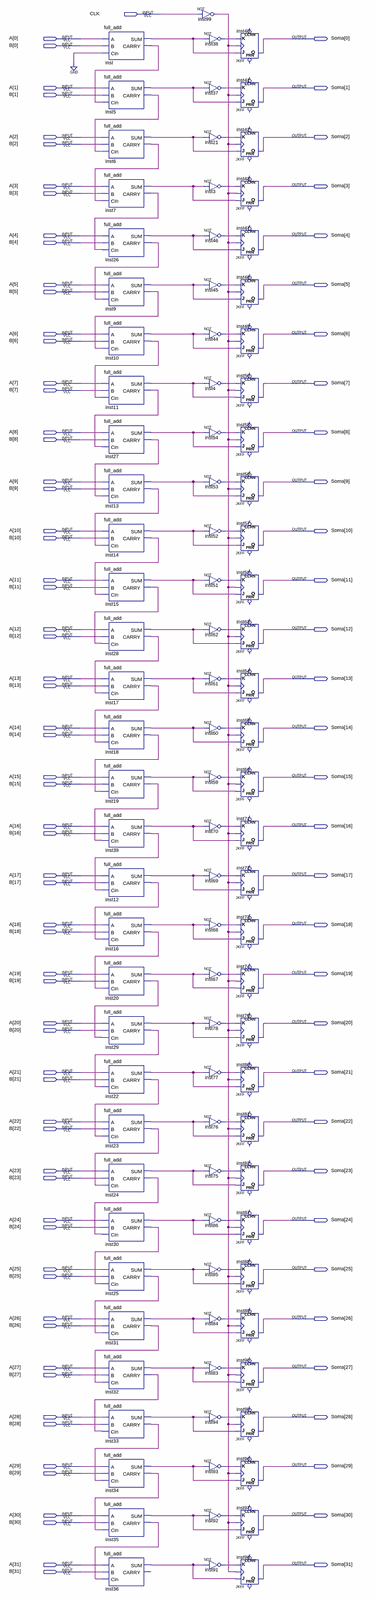
[diagram p0: schematic sheet, whole]
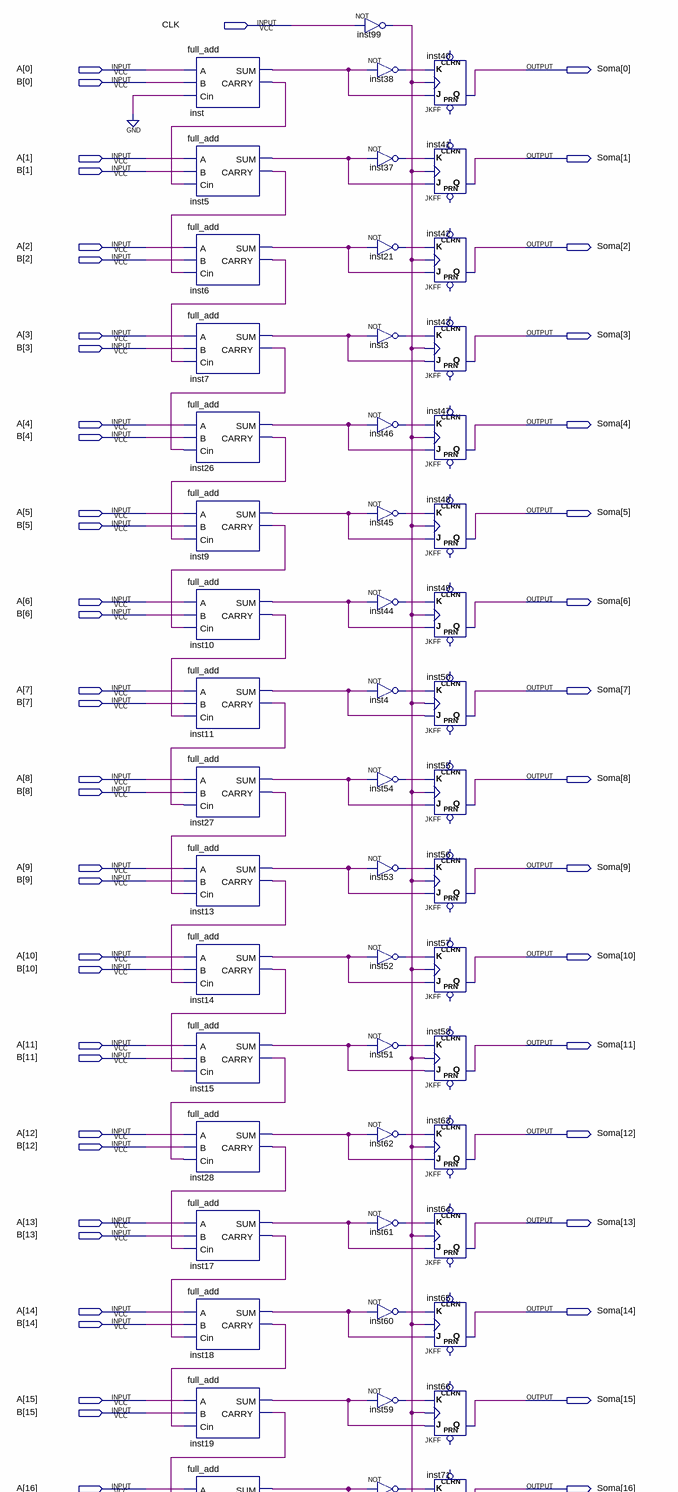
[diagram p1: schematic sheet, upper part]
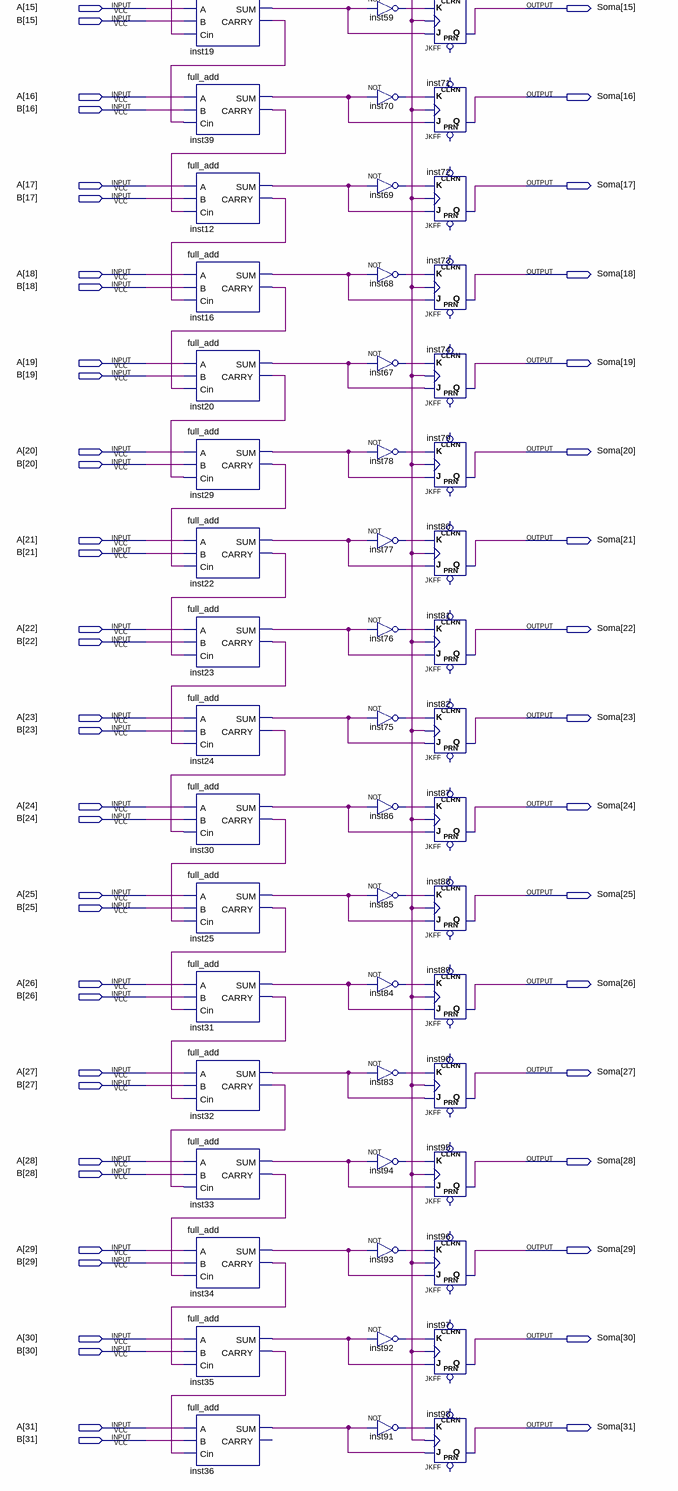
[diagram p2: schematic sheet, lower part]
// Quartus schematic add32-sincrono.bdf as structural Verilog: 97 symbols, 97 pins
module \add32-sincrono  (
  input  CLK,
  input  [31:0] A,
  input  [31:0] B,
  output [31:0] Soma
);

  wire inst3_out, inst4_out, inst5_carry, inst5_sum, inst6_carry, inst6_sum, inst7_carry, inst7_sum,
       inst9_carry, inst9_sum, inst10_carry, inst10_sum, inst11_carry, inst11_sum, inst12_carry, inst12_sum,
       inst13_carry, inst13_sum, inst14_carry, inst14_sum, inst15_carry, inst15_sum, inst16_carry,
       inst16_sum, inst17_carry, inst17_sum, inst18_carry, inst18_sum, inst19_carry, inst19_sum,
       inst20_carry, inst20_sum, inst21_out, inst22_carry, inst22_sum, inst23_carry, inst23_sum,
       inst24_carry, inst24_sum, inst25_carry, inst25_sum, inst26_carry, inst26_sum, inst27_carry,
       inst27_sum, inst28_carry, inst28_sum, inst29_carry, inst29_sum, inst30_carry, inst30_sum,
       inst31_carry, inst31_sum, inst32_carry, inst32_sum, inst33_carry, inst33_sum, inst34_carry,
       inst34_sum, inst35_carry, inst35_sum, inst36_sum, inst37_out, inst38_out, inst39_carry, inst39_sum,
       inst44_out, inst45_out, inst46_out, inst51_out, inst52_out, inst53_out, inst54_out, inst59_out,
       inst60_out, inst61_out, inst62_out, inst67_out, inst68_out, inst69_out, inst70_out, inst75_out,
       inst76_out, inst77_out, inst78_out, inst83_out, inst84_out, inst85_out, inst86_out, inst91_out,
       inst92_out, inst93_out, inst94_out, inst99_out, inst_carry, inst_sum;

  full_add inst (.A(A[0]), .B(B[0]), .Cin(1'b0), .SUM(inst_sum), .CARRY(inst_carry));
  full_add inst5 (.A(A[1]), .B(B[1]), .Cin(inst_carry), .SUM(inst5_sum), .CARRY(inst5_carry));
  full_add inst6 (.A(A[2]), .B(B[2]), .Cin(inst5_carry), .SUM(inst6_sum), .CARRY(inst6_carry));
  full_add inst7 (.A(A[3]), .B(B[3]), .Cin(inst6_carry), .SUM(inst7_sum), .CARRY(inst7_carry));
  full_add inst26 (.A(A[4]), .B(B[4]), .Cin(inst7_carry), .SUM(inst26_sum), .CARRY(inst26_carry));
  full_add inst9 (.A(A[5]), .B(B[5]), .Cin(inst26_carry), .SUM(inst9_sum), .CARRY(inst9_carry));
  full_add inst10 (.A(A[6]), .B(B[6]), .Cin(inst9_carry), .SUM(inst10_sum), .CARRY(inst10_carry));
  full_add inst11 (.A(A[7]), .B(B[7]), .Cin(inst10_carry), .SUM(inst11_sum), .CARRY(inst11_carry));
  full_add inst27 (.A(A[8]), .B(B[8]), .Cin(inst11_carry), .SUM(inst27_sum), .CARRY(inst27_carry));
  full_add inst13 (.A(A[9]), .B(B[9]), .Cin(inst27_carry), .SUM(inst13_sum), .CARRY(inst13_carry));
  full_add inst14 (.A(A[10]), .B(B[10]), .Cin(inst13_carry), .SUM(inst14_sum), .CARRY(inst14_carry));
  full_add inst15 (.A(A[11]), .B(B[11]), .Cin(inst14_carry), .SUM(inst15_sum), .CARRY(inst15_carry));
  full_add inst28 (.A(A[12]), .B(B[12]), .Cin(inst15_carry), .SUM(inst28_sum), .CARRY(inst28_carry));
  full_add inst17 (.A(A[13]), .B(B[13]), .Cin(inst28_carry), .SUM(inst17_sum), .CARRY(inst17_carry));
  full_add inst18 (.A(A[14]), .B(B[14]), .Cin(inst17_carry), .SUM(inst18_sum), .CARRY(inst18_carry));
  full_add inst19 (.A(A[15]), .B(B[15]), .Cin(inst18_carry), .SUM(inst19_sum), .CARRY(inst19_carry));
  full_add inst39 (.A(A[16]), .B(B[16]), .Cin(inst19_carry), .SUM(inst39_sum), .CARRY(inst39_carry));
  full_add inst12 (.A(A[17]), .B(B[17]), .Cin(inst39_carry), .SUM(inst12_sum), .CARRY(inst12_carry));
  full_add inst16 (.A(A[18]), .B(B[18]), .Cin(inst12_carry), .SUM(inst16_sum), .CARRY(inst16_carry));
  full_add inst20 (.A(A[19]), .B(B[19]), .Cin(inst16_carry), .SUM(inst20_sum), .CARRY(inst20_carry));
  full_add inst29 (.A(A[20]), .B(B[20]), .Cin(inst20_carry), .SUM(inst29_sum), .CARRY(inst29_carry));
  full_add inst22 (.A(A[21]), .B(B[21]), .Cin(inst29_carry), .SUM(inst22_sum), .CARRY(inst22_carry));
  full_add inst23 (.A(A[22]), .B(B[22]), .Cin(inst22_carry), .SUM(inst23_sum), .CARRY(inst23_carry));
  full_add inst24 (.A(A[23]), .B(B[23]), .Cin(inst23_carry), .SUM(inst24_sum), .CARRY(inst24_carry));
  full_add inst30 (.A(A[24]), .B(B[24]), .Cin(inst24_carry), .SUM(inst30_sum), .CARRY(inst30_carry));
  full_add inst25 (.A(A[25]), .B(B[25]), .Cin(inst30_carry), .SUM(inst25_sum), .CARRY(inst25_carry));
  full_add inst31 (.A(A[26]), .B(B[26]), .Cin(inst25_carry), .SUM(inst31_sum), .CARRY(inst31_carry));
  full_add inst32 (.A(A[27]), .B(B[27]), .Cin(inst31_carry), .SUM(inst32_sum), .CARRY(inst32_carry));
  full_add inst33 (.A(A[28]), .B(B[28]), .Cin(inst32_carry), .SUM(inst33_sum), .CARRY(inst33_carry));
  full_add inst34 (.A(A[29]), .B(B[29]), .Cin(inst33_carry), .SUM(inst34_sum), .CARRY(inst34_carry));
  full_add inst35 (.A(A[30]), .B(B[30]), .Cin(inst34_carry), .SUM(inst35_sum), .CARRY(inst35_carry));
  full_add inst36 (.A(A[31]), .B(B[31]), .Cin(inst35_carry), .SUM(inst36_sum));  // open: CARRY
  not inst99 (inst99_out, CLK);
  not inst38 (inst38_out, inst_sum);
  not inst37 (inst37_out, inst5_sum);
  not inst21 (inst21_out, inst6_sum);
  not inst3 (inst3_out, inst7_sum);
  not inst46 (inst46_out, inst26_sum);
  not inst45 (inst45_out, inst9_sum);
  not inst44 (inst44_out, inst10_sum);
  not inst4 (inst4_out, inst11_sum);
  not inst54 (inst54_out, inst27_sum);
  not inst53 (inst53_out, inst13_sum);
  not inst52 (inst52_out, inst14_sum);
  not inst51 (inst51_out, inst15_sum);
  not inst62 (inst62_out, inst28_sum);
  not inst61 (inst61_out, inst17_sum);
  not inst60 (inst60_out, inst18_sum);
  not inst59 (inst59_out, inst19_sum);
  not inst70 (inst70_out, inst39_sum);
  not inst69 (inst69_out, inst12_sum);
  not inst68 (inst68_out, inst16_sum);
  not inst67 (inst67_out, inst20_sum);
  not inst78 (inst78_out, inst29_sum);
  not inst77 (inst77_out, inst22_sum);
  not inst76 (inst76_out, inst23_sum);
  not inst75 (inst75_out, inst24_sum);
  not inst86 (inst86_out, inst30_sum);
  not inst85 (inst85_out, inst25_sum);
  not inst84 (inst84_out, inst31_sum);
  not inst83 (inst83_out, inst32_sum);
  not inst94 (inst94_out, inst33_sum);
  not inst93 (inst93_out, inst34_sum);
  not inst92 (inst92_out, inst35_sum);
  not inst91 (inst91_out, inst36_sum);
  JKFF inst40 (.K(inst38_out), .J(inst_sum), .CLK(inst99_out), .Q(Soma[0]));  // open: PRN, CLRN
  JKFF inst41 (.K(inst37_out), .J(inst5_sum), .CLK(inst99_out), .Q(Soma[1]));  // open: PRN, CLRN
  JKFF inst42 (.K(inst21_out), .J(inst6_sum), .CLK(inst99_out), .Q(Soma[2]));  // open: PRN, CLRN
  JKFF inst43 (.K(inst3_out), .J(inst7_sum), .CLK(inst99_out), .Q(Soma[3]));  // open: PRN, CLRN
  JKFF inst47 (.K(inst46_out), .J(inst26_sum), .CLK(inst99_out), .Q(Soma[4]));  // open: PRN, CLRN
  JKFF inst48 (.K(inst45_out), .J(inst9_sum), .CLK(inst99_out), .Q(Soma[5]));  // open: PRN, CLRN
  JKFF inst49 (.K(inst44_out), .J(inst10_sum), .CLK(inst99_out), .Q(Soma[6]));  // open: PRN, CLRN
  JKFF inst50 (.K(inst4_out), .J(inst11_sum), .CLK(inst99_out), .Q(Soma[7]));  // open: PRN, CLRN
  JKFF inst55 (.K(inst54_out), .J(inst27_sum), .CLK(inst99_out), .Q(Soma[8]));  // open: PRN, CLRN
  JKFF inst56 (.K(inst53_out), .J(inst13_sum), .CLK(inst99_out), .Q(Soma[9]));  // open: PRN, CLRN
  JKFF inst57 (.K(inst52_out), .J(inst14_sum), .CLK(inst99_out), .Q(Soma[10]));  // open: PRN, CLRN
  JKFF inst58 (.K(inst51_out), .J(inst15_sum), .CLK(inst99_out), .Q(Soma[11]));  // open: PRN, CLRN
  JKFF inst63 (.K(inst62_out), .J(inst28_sum), .CLK(inst99_out), .Q(Soma[12]));  // open: PRN, CLRN
  JKFF inst64 (.K(inst61_out), .J(inst17_sum), .CLK(inst99_out), .Q(Soma[13]));  // open: PRN, CLRN
  JKFF inst65 (.K(inst60_out), .J(inst18_sum), .CLK(inst99_out), .Q(Soma[14]));  // open: PRN, CLRN
  JKFF inst66 (.K(inst59_out), .J(inst19_sum), .CLK(inst99_out), .Q(Soma[15]));  // open: PRN, CLRN
  JKFF inst71 (.K(inst70_out), .J(inst39_sum), .CLK(inst99_out), .Q(Soma[16]));  // open: PRN, CLRN
  JKFF inst72 (.K(inst69_out), .J(inst12_sum), .CLK(inst99_out), .Q(Soma[17]));  // open: PRN, CLRN
  JKFF inst73 (.K(inst68_out), .J(inst16_sum), .CLK(inst99_out), .Q(Soma[18]));  // open: PRN, CLRN
  JKFF inst74 (.K(inst67_out), .J(inst20_sum), .CLK(inst99_out), .Q(Soma[19]));  // open: PRN, CLRN
  JKFF inst79 (.K(inst78_out), .J(inst29_sum), .CLK(inst99_out), .Q(Soma[20]));  // open: PRN, CLRN
  JKFF inst80 (.K(inst77_out), .J(inst22_sum), .CLK(inst99_out), .Q(Soma[21]));  // open: PRN, CLRN
  JKFF inst81 (.K(inst76_out), .J(inst23_sum), .CLK(inst99_out), .Q(Soma[22]));  // open: PRN, CLRN
  JKFF inst82 (.K(inst75_out), .J(inst24_sum), .CLK(inst99_out), .Q(Soma[23]));  // open: PRN, CLRN
  JKFF inst87 (.K(inst86_out), .J(inst30_sum), .CLK(inst99_out), .Q(Soma[24]));  // open: PRN, CLRN
  JKFF inst88 (.K(inst85_out), .J(inst25_sum), .CLK(inst99_out), .Q(Soma[25]));  // open: PRN, CLRN
  JKFF inst89 (.K(inst84_out), .J(inst31_sum), .CLK(inst99_out), .Q(Soma[26]));  // open: PRN, CLRN
  JKFF inst90 (.K(inst83_out), .J(inst32_sum), .CLK(inst99_out), .Q(Soma[27]));  // open: PRN, CLRN
  JKFF inst95 (.K(inst94_out), .J(inst33_sum), .CLK(inst99_out), .Q(Soma[28]));  // open: PRN, CLRN
  JKFF inst96 (.K(inst93_out), .J(inst34_sum), .CLK(inst99_out), .Q(Soma[29]));  // open: PRN, CLRN
  JKFF inst97 (.K(inst92_out), .J(inst35_sum), .CLK(inst99_out), .Q(Soma[30]));  // open: PRN, CLRN
  JKFF inst98 (.K(inst91_out), .J(inst36_sum), .CLK(inst99_out), .Q(Soma[31]));  // open: PRN, CLRN
endmodule
